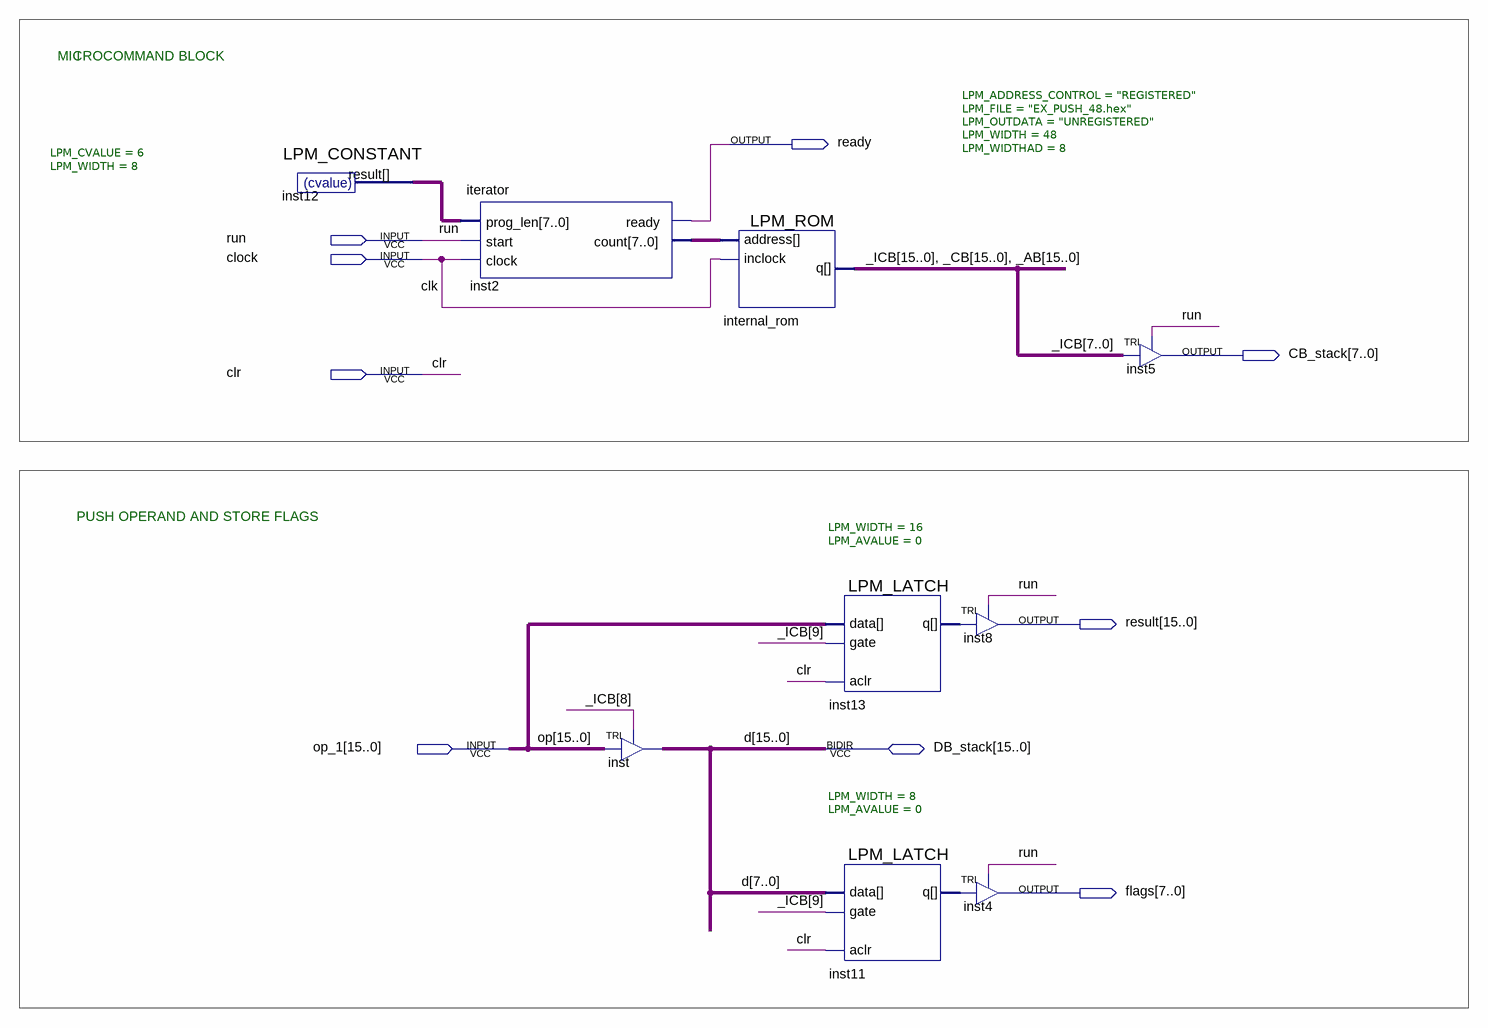
[diagram p0: schematic sheet]
// Quartus schematic EX_PUSH.bdf as structural Verilog: 9 symbols, 9 pins
module EX_PUSH (
  input  run,
  input  clock,
  input  clr,
  input  [15:0] op_1,
  inout  [15:0] DB_stack,
  output ready,
  output [7:0] CB_stack,
  output [15:0] result,
  output [7:0] flags
);

  wire [7:0] inst2_count, inst11_q, inst12_result;
  wire [15:0] _AB, _CB, _ICB, inst13_q;

  LPM_CONSTANT #(.LPM_CVALUE(6), .LPM_WIDTH(8)) inst12 (.result(inst12_result));
  iterator inst2 (.prog_len(inst12_result), .start(run), .clock(clock), .ready(ready), .count(inst2_count));
  TRI inst[15:0] (.IN(op_1), .OE(_ICB[8]), .OUT(DB_stack));
  LPM_ROM #(.LPM_ADDRESS_CONTROL("REGISTERED"), .LPM_FILE("EX_PUSH_48.hex"), .LPM_OUTDATA("UNREGISTERED"), .LPM_WIDTH(48), .LPM_WIDTHAD(8)) internal_rom (
    .address(inst2_count), .inclock(clock), .q({_ICB, _CB, _AB}));
  LPM_LATCH #(.LPM_WIDTH(16), .LPM_AVALUE(0)) inst13 (.aclr(clr), .data(op_1), .gate(_ICB[9]), .q(inst13_q));
  LPM_LATCH #(.LPM_WIDTH(8), .LPM_AVALUE(0)) inst11 (.aclr(clr), .data(DB_stack[7:0]), .gate(_ICB[9]), .q(inst11_q));
  TRI inst8[15:0] (.IN(inst13_q), .OE(run), .OUT(result));
  TRI inst4[7:0] (.IN(inst11_q), .OE(run), .OUT(flags));
  TRI inst5[7:0] (.IN(_ICB[7:0]), .OE(run), .OUT(CB_stack));

  // Other names for the same wires on the sheet: clk = clock; d[15:0] = DB_stack; op[15:0] = op_1

  // Notes on the sheet:
  //   MICROCOMMAND BLOCK
  //   I
  //   PUSH OPERAND AND STORE FLAGS
endmodule
